# Altium schematic sheet uc1.SchDoc: Microcontroller 1
size A4; Author: Marcel Hellwig; Organization: Hamburg Bit-Bots; Address1: Vogt-Kölln-Str. 30; Address2: 22527 Hamburg; Address3: Germany; Address4: www.bit-bots.de; DocumentNumber: 2; Revision: A; SheetNumber: 2; SheetTotal: 16; EMail: info@bit-bots.de
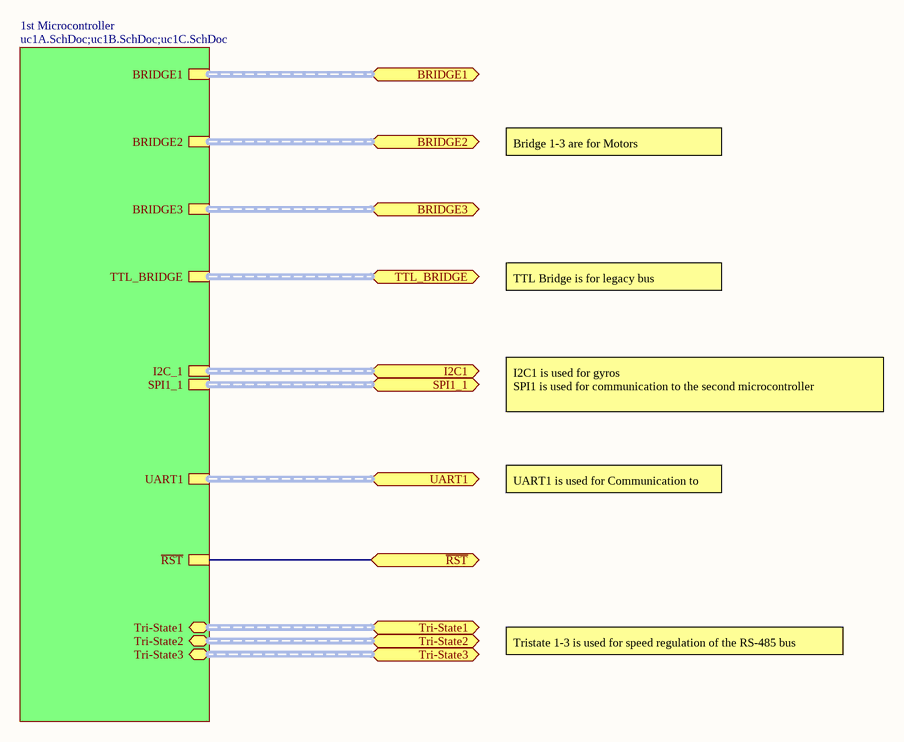
[diagram p0: uc1.SchDoc]

## Sub-sheets
1st Microcontroller = uc1A.SchDoc;uc1B.SchDoc;uc1C.SchDoc: SPI1_1 (harness SPI), I2C_1 (harness I²C), BRIDGE2 (harness UART_RS485), UART1 (harness UART), BRIDGE1 (harness UART_RS485), BRIDGE3 (harness UART_RS485), TTL_BRIDGE (harness TTL), ~{RST}, Tri-State1 (harness Tri-State), Tri-State2 (harness Tri-State), Tri-State3 (harness Tri-State)

## Ports
BRIDGE1 (harness UART_RS485), BRIDGE2 (harness UART_RS485), BRIDGE3 (harness UART_RS485), I2C1 (harness I²C), SPI1_1 (harness SPI), Tri-State1 (harness Tri-State), Tri-State2 (harness Tri-State), Tri-State3 (harness Tri-State), TTL_BRIDGE (harness TTL), UART1 (harness UART), ~{RST}

## Nets
~{RST}: port ~{RST}, sheet 1st Microcontroller/~{RST}

## Buses and harness runs
harness port BRIDGE1 = sheet 1st Microcontroller/BRIDGE1
harness port BRIDGE2 = sheet 1st Microcontroller/BRIDGE2
harness port BRIDGE3 = sheet 1st Microcontroller/BRIDGE3
harness port I2C1 = sheet 1st Microcontroller/I2C_1
harness port SPI1_1 = sheet 1st Microcontroller/SPI1_1
harness port Tri-State1 = sheet 1st Microcontroller/Tri-State1
harness port Tri-State2 = sheet 1st Microcontroller/Tri-State2
harness port Tri-State3 = sheet 1st Microcontroller/Tri-State3
harness port TTL_BRIDGE = sheet 1st Microcontroller/TTL_BRIDGE
harness port UART1 = sheet 1st Microcontroller/UART1

## Notes on the sheet
- Bridge 1-3 are for Motors
- TTL Bridge is for legacy bus
- I2C1 is used for gyros
  SPI1 is used for communication to the second microcontroller
- UART1 is used for Communication to the odroid
- Tristate 1-3 is used for speed regulation of the RS-485 bus
- Project:
- Author:
- Title:
- Rev:
- Date:
- Time:
- Sheet
- of